# Altium schematic sheet Sheet2.SchDoc
size OrCAD A
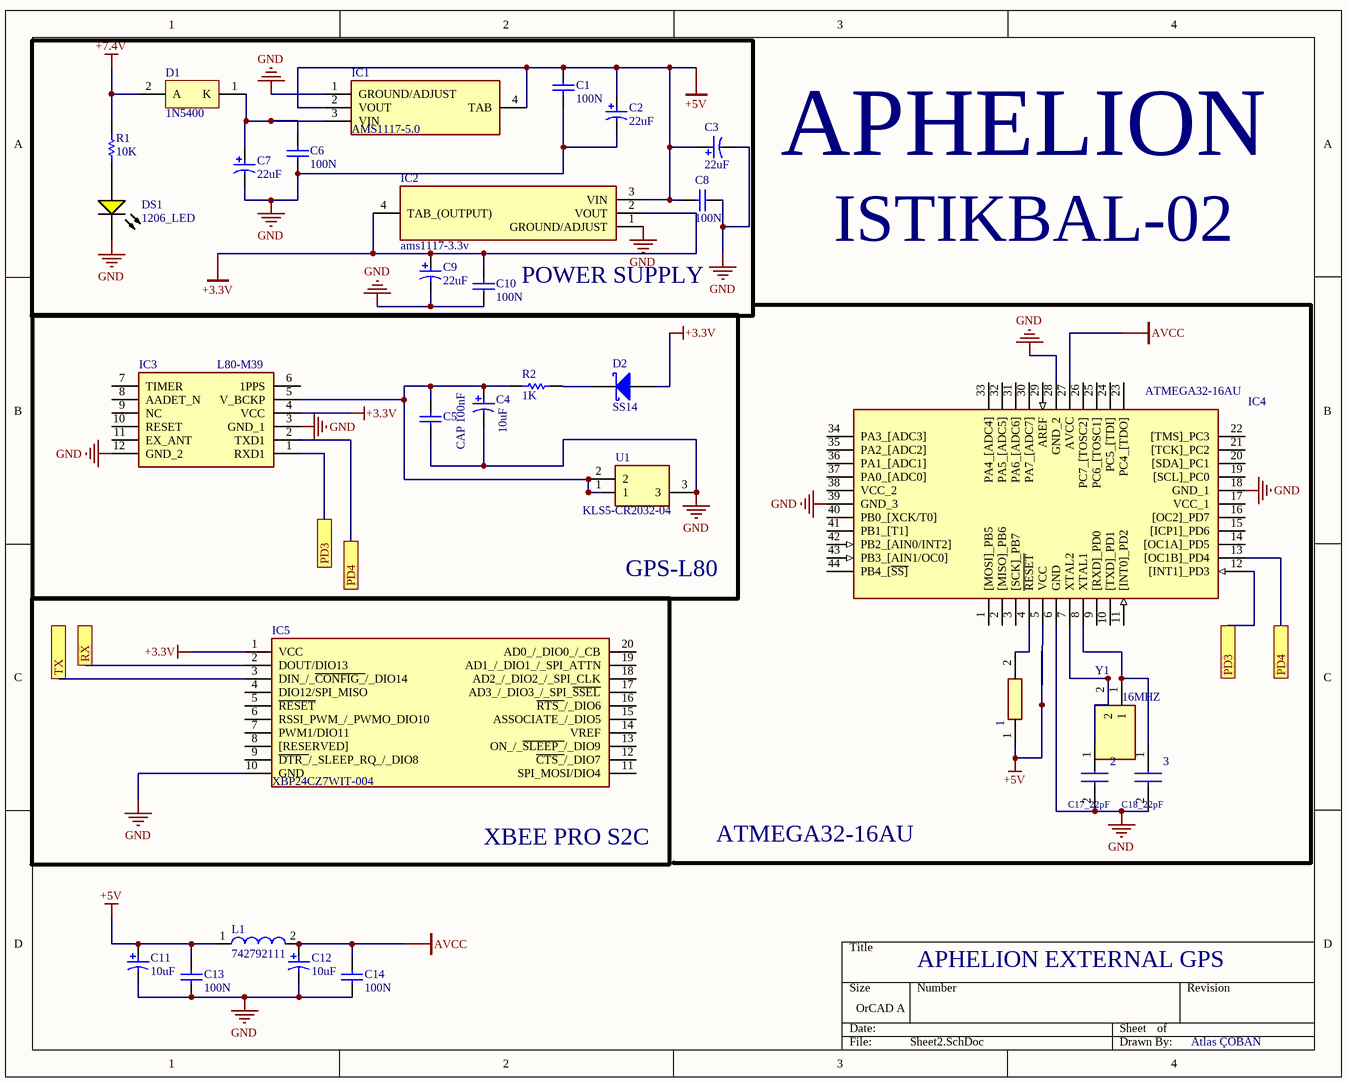
[diagram p0: Sheet2.SchDoc]

## Parts
1  (no value)  [RESC3116X65N]
2  C17_22pF  [CAPC3216X100N]
3  C18_22pF  [CAPC3216X100N]
C1  100N  [CAPC1206(3216)190_M]
C2  22uF  [AVX-TAJ-A-2_L]
C3  22uF  [AVX-TAJ-A-2_L]
C4  10uF  [CAPPR55-200-1100X500X1200]
C5  CAP 100nF  [CAPC1206(3216)190_M]
C6  100N  [CAPC1206(3216)190_M]
C7  22uF  [AVX-TAJ-A-2_L]
C8  100N  [CAPC1206(3216)190_M]
C9  22uF  [AVX-TAJ-A-2_L]
C10  100N  [CAPC1206(3216)190_M]
C11  10uF  [CAPPR55-200-1100X500X1200]
C12  10uF  [CAPPR55-200-1100X500X1200]
C13  100N  [CAPC1206(3216)190_L]
C14  100N  [CAPC1206(3216)190_L]
D1  1N5400  [ONSC-AXIAL_LEAD-2-267-05_V]
D2  SS14  [FAIR-DO-214AC-2_V]
DS1  1206_LED  [LUMX-SML-LX1206YC-TR_V]
IC1  AMS1117-5.0  [SOT229P700X180-4N]
IC2  ams1117-3.3v  [SOT229P700X180-4N]
IC3  L80-M39  [L80-M39]
IC4  ATMEGA32-16AU  [QFP80P1200X1200X120-44N]
IC5  XBP24CZ7WIT-004  [XBP24CZ7WIT004]
L1  742792111  [SMD-1206]
R1  10K  [RESC3216X70X50ML20T25]
R2  1K  [RESC3216X60X45ML15T20]
U1  KLS5-CR2032-04  [KLS5CR203204]
Y1  16MHZ  [NX5032GA16MHZSTDCSK4]

## Blocks framed on the sheet
POWER SUPPLY: C1-C3 C6-C10 D1 DS1 IC1 IC2 R1
GPS-L80: C4 C5 D2 IC3 R2 U1

## Ports
PD3, PD4, RX, TX

## Nets
+3.3V: C9.1 C10.2 D2.2(A) IC2.2(VOUT) IC2.4(TAB_(OUTPUT)) IC3.4(VCC) IC5.1(VCC)
+5V: 1.1 C1.1 C2.1 C3.1 C8.2 C11.1 C13.2 IC1.2(VOUT) IC1.4(TAB) IC2.3(VIN) IC4.5(VCC) L1.1
+7.4V: D1.2(A) R1.2
AVCC: C12.1 C14.2 IC4.27(AVCC) L1.2
GND: 2.2 3.2 C1.2 C2.2 C3.2 C4.2 C5.1 C6.1 C7.2 C8.1 C9.2 C10.1 C11.2 C12.2 C13.1 C14.1 DS1.2(K) IC1.1(GROUND/ADJUST) IC2.1(GROUND/ADJUST) IC3.3(GND_1) IC3.12(GND_2) IC4.6(GND) IC4.18(GND_1) IC4.28(GND_2) IC4.39(GND_3) IC5.10(GND) U1.3
PD3: IC3.1(RXD1) IC4.12([INT1]_PD3) ; port PD3
PD4: IC3.2(TXD1) IC4.13([OC1B]_PD4) ; port PD4
RX: IC5.2(DOUT/DIO13) ; port RX
TX: IC5.3(DIN_/_~{CONFIG_}/_DIO14) ; port TX
Net1_2: 1.2 IC4.4(~{RESET})
Net2_1: 2.1 IC4.7(XTAL2) Y1.2
Net3_1: 3.1 IC4.8(XTAL1) Y1.1
NetC4_1: C4.1 C5.2 IC3.5(V_BCKP) R2.1 U1.1 U1.2
NetC6_2: C6.2 C7.1 D1.1(K) IC1.3(VIN)
NetD2_1: D2.1(K) R2.2

Not connected (* = marked no-connect by the designer): DS1 1(A); IC3 6(1PPS) 7(TIMER) 8(AADET_N) 9(NC) 10(RESET) 11(EX_ANT); IC4 1([MOSI]_PB5) 2([MISO]_PB6) 3([SCK]_PB7) 9([RXD]_PD0) 10([TXD]_PD1) 11([INT0]_PD2) 14([OC1A]_PD5) 15([ICP1]_PD6) 16([OC2]_PD7) 17(VCC_1) 19([SCL]_PC0) 20([SDA]_PC1) 21([TCK]_PC2) 22([TMS]_PC3) 23(PC4_[TDO]) 24(PC5_[TDI]) 25(PC6_[TOSC1]) 26(PC7_[TOSC2]) 29(AREF) 30(PA7_[ADC7]) 31(PA6_[ADC6]) 32(PA5_[ADC5]) 33(PA4_[ADC4]) 34(PA3_[ADC3]) 35(PA2_[ADC2]) 36(PA1_[ADC1]) 37(PA0_[ADC0]) 38(VCC_2) 40(PB0_[XCK/T0]) 41(PB1_[T1]) 42(PB2_[AIN0/INT2]) 43(PB3_[AIN1/OC0]) 44(PB4_[~{SS]}); IC5 4(DIO12/SPI_MISO) 5(~{RESET}) 6(RSSI_PWM_/_PWMO_DIO10) 7(PWM1/DIO11) 8([RESERVED]) 9(~{DTR_}/_SLEEP_RQ_/_DIO8) 11(SPI_MOSI/DIO4) 12(~{CTS_}/_DIO7) 13(ON_/_~{SLEEP_}/_DIO9) 14(VREF) 15(ASSOCIATE_/_DIO5) 16(~{RTS_}/_DIO6) 17(AD3_/_DIO3_/_SPI_~{SSEL}) 18(AD2_/_DIO2_/_SPI_CLK) 19(AD1_/_DIO1_/_SPI_ATTN) 20(AD0_/_DIO0_/_CB); R1 1

## Notes on the sheet
- APHELION
- ISTIKBAL-02
- (near IC5) XBEE PRO S2C
- ATMEGA32-16AU
- APHELION EXTERNAL GPS
- Atlas ÇOBAN

## Library data of the parts
1 = MC1206S4F5600T5E: Resistor; Manufacturer_Name: MULTICOMP; Datasheet Link: http://www.newark.com/pdfs/datasheets/spc/TA-677.pdf?_ga=1.248182791.1411154270.1472651675; Height: 0.65mm; Manufacturer_Part_Number: MC1206S4F5600T5E
2 3 = CL31B104KBCNNNC: Capacitor; Manufacturer_Name: Samsung Electro-Mechanics; Datasheet Link: http://www.samsungsem.com/kr/support/product-search/mlcc/CL31B104KBCNNNC.jsp; Height: 1mm; Manufacturer_Part_Number: CL31B104KBCNNNC; RS Part Number: 7666947; RS Price/Stock: http://uk.rs-online.com/web/p/products/7666947
C1 C5 C6 C8 C10 = CMP-1037-04189-1: CAP 100nF 25V ±5% 1206 (3216 Metric) Thickness 1.9mm SMD; Case-Metric: 3216; Case-EIA: 1206; Tolerance: Â±5%; Rated Voltage: 25 V; Technology: SMT; Max Thickness: 1.9 mm; Value: 100nF
C2 C3 C7 C9 = CMP-2000-07524-1: Chip Capacitor, 22 uF, +/- 10%, 10 V, -55 to 125 degC, 1206 (3216 Metric), RoHS, Tape and Reel; Manufacturer: AVX; Leakage Current: 2.2uA; Polarity: Polar; Dielectric Material: Tantalum; Voltage Rating (DC): 10V; Dissipation Factor: 8%; ESR (Equivalent Series Resistance): 3Ohm; Height - Seated (Max): 0.071inch; Number of Pins: 2; Termination: SMD/SMT; Package Quantity: 1; Datasheet Version: 09/2017; Packaging: TapeandReel; Case/Package: 1206; Lead Free: LeadFree; Manufacturer URL: http://www.avx.com/; RoHSCompliant: True; Mount: PCB; Package Reference: TAJ-A-2; Width: 1.6mm; Height: 1.6mm; Radiation Hardening: No; Lead Pitch: 1.1mm; Tolerance: 10%; REACH SVHC: NoSVHC; Depth: 1.6mm; Package Description: 2-Pin Surface Mount Device, Body 3.2 x 1.65 mm; Case Code (Metric): 3216; Case Code (Imperial): 1206; Mounting Technology: SurfaceMount; Datasheet URL: http://datasheets.avx.com/TAJ.pdf; Capacitance: 22uF; Voltage: 10V; Length: 3.2mm; Max Operating Temperature: 125degC; Voltage Rating: 10V; Min Operating Temperature: -55degC
C4 C11 C12 = CMP-2100-03622-1: Aluminum Electrolytic Capacitor, 10 uF, +/- 20%, 50 V, -40 to 85 degC, 2-Pin THD, RoHS, Bulk; Manufacturer: Panasonic; Life (Hours): 2000Hour; Lead/Base Style: Straight; Dissipation Factor: 0.12%; Leakage Current: 3uA; Dielectric Material: Aluminium; Lead Diameter: 0.5mm; Voltage Rating: 50V; Ripple Current: 65mA; Package Reference: CAPPR55-200-1100X500X1200; Height: 11mm; Diameter: 5mm; REACH SVHC: NoSVHC; Mount: ThroughHole; Packaging: Bulk; Manufacturer URL: http://www.panasonic.com/; Capacitance: 10uF; Termination: Radial; Datasheet URL: https://industrial.panasonic.com/cdbs/www-data/pdf/RDF0000/ABA0000C1218.pdf; Lead Free: LeadFree; Height - Seated (Max): 0.472inch; Case/Package: Radial; Package Description: 2-Pin Radial Lead, Dia 5 mm, Height 12 mm; Tolerance: 20%; Datasheet Version: Rev. 05, 10/2016; Package Quantity: 200; Ripple Current (AC): 65mA; Min Operating Temperature: -40degC; RoHSCompliant: true; Number of Pins: 2; Max Operating Temperature: 85degC; Voltage: 50V; Lead Pitch: 2mm; Radiation Hardening: No; Voltage Rating (DC): 50V; Length: 11mm
C13 C14 = CMP-1037-04186-1: CAP 100nF 25V ±1% 1206 (3216 Metric) Thickness 1.9mm SMD; Case-Metric: 3216; Tolerance: Â±1%; Case-EIA: 1206; Technology: SMT; Max Thickness: 1.9 mm; Rated Voltage: 25 V; Value: 100nF
D1 = CMP-0902-00082-1: Standard Recovery Rectifier, 2-Pin Axial_Lead, Pb-Free, Bulk Box; Manufacturer: On Semiconductor; VRRM Max (V): 50; IFSM Max (A): 200; IO(rec) Max (A): 3; ComponentLink1URL: http://www.onsemi.com/; DatasheetVersion: Rev. 10; RoHS: TRUE; PackageReference: AXIAL_LEAD-2-267-05; ComponentLink3URL: http://www.onsemi.com/pub_link/Collateral/267-05.PDF; Type: Standard Recovery; ComponentLink1Description: Manufacturer URL; PackageVersion: Rev. G, 06/2000; ComponentLink2Description: Datasheet; PackageDescription: 2-Pin, Axial Lead, Diameter 5.05 mm; ComponentLink2URL: http://www.onsemi.com/pub_link/Collateral/1N5400-D.PDF; Packing: Bulk Box; Mounting Technology: Through Hole; PartNumber: 1N5400; ComponentLink3Description: Package Specification
D2 = CMP-2000-04943-1: Schottky Rectifier, 1.1 W, -65 to 125 degC, 2-Pin SMD, RoHS, Tape and Reel; Manufacturer: Fairchild; Configuration: SINGLE; Diode Element Material: SILICON; Power Dissipation Limit-Max (W): 1.1; Additional Feature: FREEWHEELINGDIODE; Signal Diode Type: SIGNALDIODE; Number of Elements: 1; JEDEC-95 Code: DO-214AC; Rep Pk Reverse Voltage-Max (V): 40; Package Body Material: PLASTIC/EPOXY; CAGE Code: 1HBD3,07933,59621,7D893; Peak Reflow Temperature (Cel): 260; Package Shape: RECTANGULAR; Manufacturer URL: https://www.fairchildsemi.com/; JESD-97 Code: e3; Package Reference: DO-214AC-2; RoHS Compliant: YES; Package Description: 2-Pin Surface Mount Device, Body 4.375 x 2.725 mm; Technology: SCHOTTKY; Surface Mount: YES; Datasheet URL: http://www.onlinecomponents.com/datasheet/ss14.aspx?p=11369800; Terminal Form: CBEND; Package Style: SMALLOUTLINE; Number of Terminals: 2; JESD-30 Code: R-PDSO-C2; Average Forward Current-Max (A): 1; Terminal Finish: MATTETIN; Datasheet Version: Oct-13; Terminal Position: DUAL; Package URL: https://www.fairchildsemi.com/package-drawings/DO/DO214AC.pdf; Moisture Sensitivity Level: 1; Lead Free: YES
DS1 = CMP-2000-07124-1: Yellow LED, Water Clear Len, 585 nm, 2.1 V, -40 to 85 degC, 2-Pin SMD, RoHS, Tape and Reel; Manufacturer: Lumex; Product Training Modules: LEDsBenefitsofCustomLEDandLCDTechnology; Millicandela Rating: 6mcd; Catalog Drawings: SML-LX1206SeriesTopSML-LX1206SeriesSideSML-LX1206SeriesBottomSML-LX1206SeriesFootprint; Wavelength - Peak: 585nm; Other Names: 67-1358-2LU60357TRSMLLX1206YCTR; Lens Style/Size: RectanglewithFlatTop; Current - Test: 20mA; Lens Color: Colorless; Viewing Angle: 160°; Voltage - Forward (Vf) (Typ): 2.1V; Online Catalog: SML-LX1206RectanglewithFlatTop1206PackageLEDs; Mounting Type: SurfaceMount; Package Description: 2-Pin Surface Mount Device, Body 3.2 x 1.5 mm; Datasheet Version: Rev. K, 08/2012; Features: -; Color: Yellow; RoHS Information: RoHSCertofCompliance; Package Reference: SML-LX1206YC-TR; Supplier Device Package: 1206; Standard Package: 3,000; Series: -; Wavelength - Dominant: -; Package / Case: 1206(3216Metric); Mounting Technology: SurfaceMount; Height (Max): 1.10mm; Lens Transparency: Clear; Datasheet URL: http://www.lumex.com/content/files/ProductAttachment/SML-LX1206YC-TR.pdf; Family: LEDIndication-Discrete; Manufacturer URL: http://www.lumexinstruments.com/; Packaging: Tape&Reel(TR); Category: Optoelectronics; Size / Dimension: 3.20mmLx1.60mmW
IC1 = AMS1117-5.0: Integrated Circuit; Manufacturer_Name: Advanced Monolithic Systems; Datasheet Link: http://www.advanced-monolithic.com/pdf/ds1117.pdf; Height: 1.8mm; Manufacturer_Part_Number: AMS1117-5.0
IC2 = ams1117-3.3v: Integrated Circuit; Manufacturer_Name: Advanced Monolithic Systems; Datasheet Link: http://www.advanced-monolithic.com/pdf/ds1117.pdf; Height: 1.8mm; Manufacturer_Part_Number: ams1117-3.3v
IC3 = L80-M39: Integrated Circuit; Manufacturer_Name: Quectel; Datasheet Link: http://docs-emea.rs-online.com/webdocs/147d/0900766b8147dbf2.pdf; Manufacturer_Part_Number: L80-M39; RS Part Number: 9084088; RS Price/Stock: http://uk.rs-online.com/web/p/products/9084088
IC4 = ATMEGA32-16AU: Integrated Circuit; Manufacturer_Name: Microchip; Datasheet Link: http://docs-emea.rs-online.com/webdocs/091f/0900766b8091f466.pdf; Height: 1.2mm; Manufacturer_Part_Number: ATMEGA32-16AU; Mouser Part Number: 556-ATMEGA32-16AU; Mouser Price/Stock: https://www.mouser.com/Search/Refine.aspx?Keyword=556-ATMEGA32-16AU; RS Part Number: 6281485P; RS Price/Stock: http://uk.rs-online.com/web/p/products/6281485P
IC5 = XBP24CZ7WIT-004: Integrated Circuit; Manufacturer_Name: Digi International; Datasheet Link: https://componentsearchengine.com/Datasheets/1/XBP24CZ7WIT-004.pdf; Height: 2.79mm; Manufacturer_Part_Number: XBP24CZ7WIT-004; Mouser Part Number: 888-XBP24CZ7WIT-004; Mouser Price/Stock: https://www.mouser.com/Search/Refine.aspx?Keyword=888-XBP24CZ7WIT-004; RS Part Number: 1359739; RS Price/Stock: http://uk.rs-online.com/web/p/products/1359739
L1 = CMP-0220-00024-1: SMD EMI Suppression Ferrite Bead WE-CBF, Z = 26 Ohm; Impedance: 26 Ohm; ComponentLink2Description: Datasheet; PackageReference: SMD-1206; ComponentLink2URL: http://www.we-online.de/katalog/media/pdf/742792111.pdf; PackageVersion: 2007; DatasheetVersion: Dec-2005; PackageDescription: Chip Inductor, 2-Leads, Body 3.2 x 1.6 mm; ComponentLink1URL: http://www.we-online.com; ComponentLink1Description: Manufacturer Link
R1 = CMP-2003-04438-1: Part Number: ERA8AEB221V; Manufacturer: Panasonic
R2 = CMP-2100-03616-1: Chip Resistor, 1 KOhm, +/- 1%, 0.25 W, -55 to 155 degC, 1206 (3216 Metric), RoHS, Tape and Reel; Manufacturer: Vishay Semiconductor; Power Rating: 250mW; Voltage Rating (DC): 200V; Resistance: 1KOhm; Temperature Coefficient: 100ppm/degreesC; Case Code (Imperial): 1206; Length: 3.2mm; Case/Package: 1206; Contact Plating: Tin; Package Quantity: 10; Datasheet URL: http://www.farnell.com/datasheets/1720486.pdf; Mount: SurfaceMount; Package Description: 2-Pin Surface Mount Device, Body 3.15 x 1.6 mm; Package Reference: 1206.0; Max Operating Temperature: 155degC; Lead Free: LeadFree; Weight: 0.000353oz; Military Standard: Not; Max Power Dissipation: 250mW; Case Code (Metric): 3216; Number of Terminations: 2; Tolerance: 1%; Width: 0.063inch; Termination: SMD/SMT; Number of Pins: 2; Min Operating Temperature: -55degC; Height: 0.55mm; Depth: 1.6mm; RoHSCompliant: true; Composition: ThickFilm; Packaging: TapeandReel; Manufacturer URL: http://www.vishay.com/; Voltage Rating: 200V; Radiation Hardening: No; REACH SVHC: Unknown; Datasheet Version: 41061.0
U1 = KLS5-CR2032-04: Undefined or Miscellaneous; Manufacturer_Name: KLS Electronic; Datasheet Link: http://www.klsele.com/admin/product_upload/20151124101114KLS5-CR2032-04.pdf; Height: 18.13mm; Manufacturer_Part_Number: KLS5-CR2032-04
Y1 = NX5032GA-16MHZ-STD-CSK-4: Crystal or Oscillator; Manufacturer_Name: NDK; Datasheet Link: http://www.ndk.com/images/products/catalog/c_NX5032GA_e.pdf; Height: 1.5mm; Manufacturer_Part_Number: NX5032GA-16MHZ-STD-CSK-4